# EAGLE design pidshield-mk-1 (EAGLE 6.5.0)
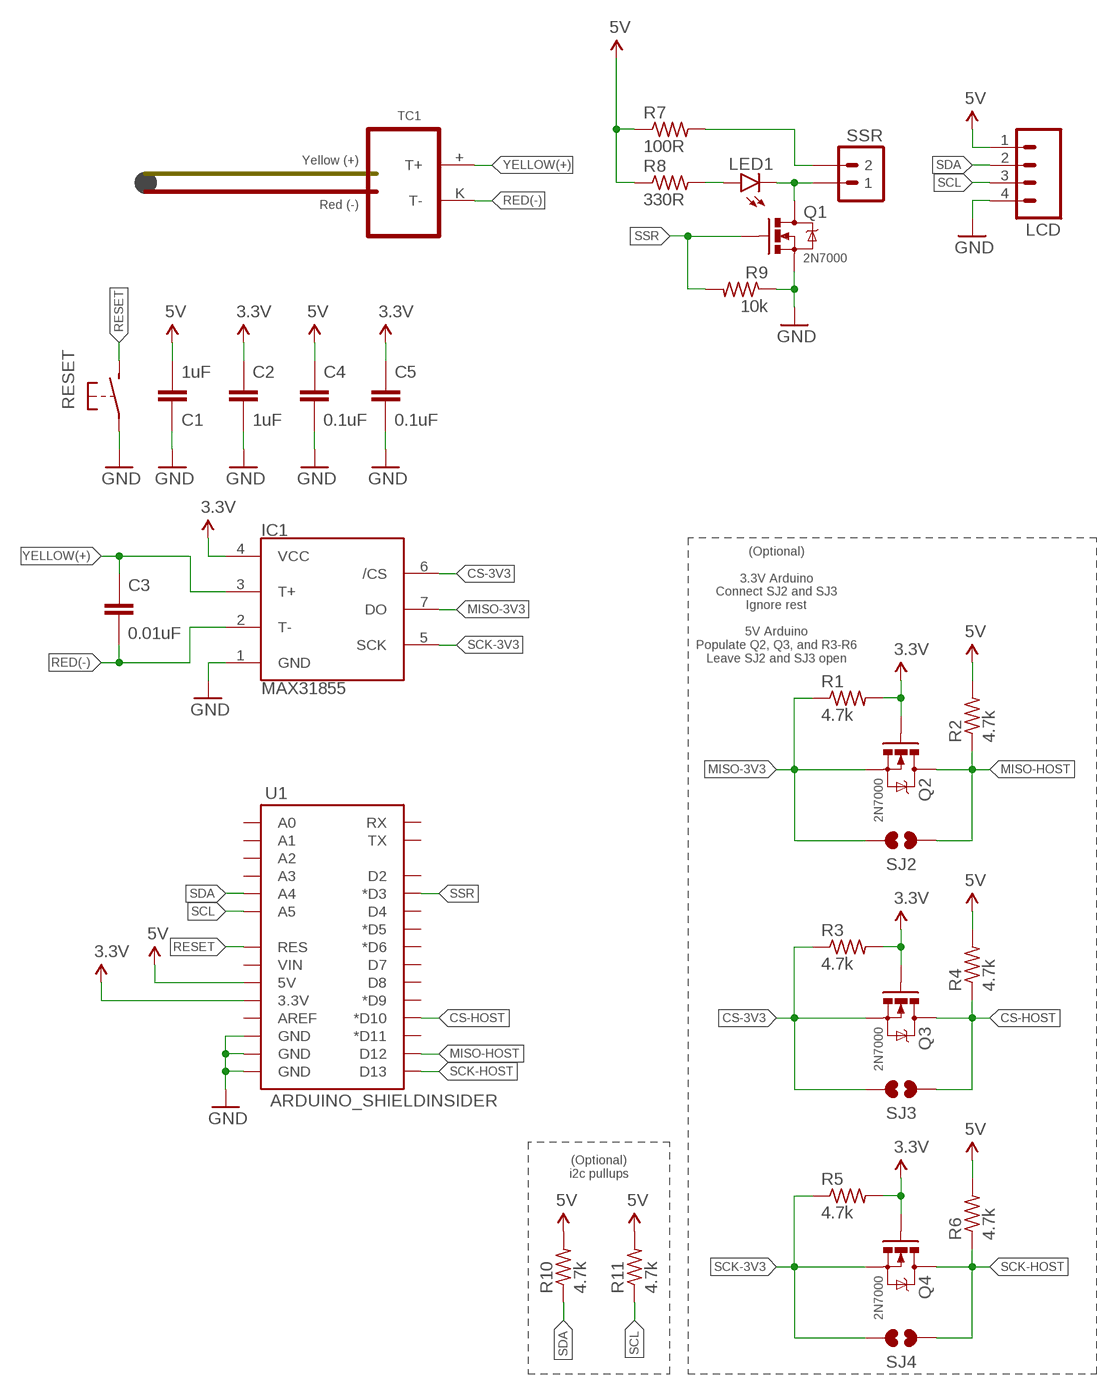
[diagram p0: schematic, sheet 1]

## Parts
C1  1uF  CAPACITOR-CERAMIC025-024X044  [C025-024X044]
C2  1uF  CAPACITOR-CERAMIC025-024X044  [C025-024X044]
C3  0.01uF  CAPACITOR-CERAMIC025-024X044  [C025-024X044]
C4  0.1uF  CAPACITOR-CERAMIC025-024X044  [C025-024X044]
C5  0.1uF  CAPACITOR-CERAMIC025-024X044  [C025-024X044]
IC1  MAX31855  MAX31855SOIC  [SOIC127P600X175-8N]
LCD  M04JST_XH_RA  [JST-4-XH-RA-PTH]
LED1  LED3MM  [LED3MM]
Q1  2N7000  MOSFET-NCHANNEL2N7000-AMMO  [TO-92-AMMO]
Q2  2N7000  MOSFET-NCHANNEL2N7000-AMMO  [TO-92-AMMO]
Q3  2N7000  MOSFET-NCHANNEL2N7000-AMMO  [TO-92-AMMO]
Q4  2N7000  MOSFET-NCHANNEL2N7000-AMMO  [TO-92-AMMO]
R1  4.7k  RESISTORPTH-AXIAL-6.35MM  [RESISTOR-AXIAL-PTH-6.35MM]
R2  4.7k  RESISTORPTH-AXIAL-6.35MM  [RESISTOR-AXIAL-PTH-6.35MM]
R3  4.7k  RESISTORPTH-AXIAL-6.35MM  [RESISTOR-AXIAL-PTH-6.35MM]
R4  4.7k  RESISTORPTH-AXIAL-6.35MM  [RESISTOR-AXIAL-PTH-6.35MM]
R5  4.7k  RESISTORPTH-AXIAL-6.35MM  [RESISTOR-AXIAL-PTH-6.35MM]
R6  4.7k  RESISTORPTH-AXIAL-6.35MM  [RESISTOR-AXIAL-PTH-6.35MM]
R7  100R  RESISTORPTH-AXIAL-6.35MM  [RESISTOR-AXIAL-PTH-6.35MM]
R8  330R  RESISTORPTH-AXIAL-6.35MM  [RESISTOR-AXIAL-PTH-6.35MM]
R9  10k  RESISTORPTH-AXIAL-6.35MM  [RESISTOR-AXIAL-PTH-6.35MM]
R10  4.7k  RESISTORPTH-AXIAL-6.35MM  [RESISTOR-AXIAL-PTH-6.35MM]
R11  4.7k  RESISTORPTH-AXIAL-6.35MM  [RESISTOR-AXIAL-PTH-6.35MM]
RESET  SPST-NO-TACT3MM-RA  [TACTILE-PTH-SIDE]
SJ2  JUMPER-PAD-2-NOYES_SILK  [PAD-JUMPER-2-NO_YES_SILK]
SJ3  JUMPER-PAD-2-NOYES_SILK  [PAD-JUMPER-2-NO_YES_SILK]
SJ4  JUMPER-PAD-2-NOYES_SILK  [PAD-JUMPER-2-NO_YES_SILK]
SSR  M02JST-PTH-RA-SMALLPADS  [JST-2-PH-RA-PTH-SMALLPADS]
TC1  PCC-SMP-K  THERMOCOUPLE-CONNECTORMINI-PCB  [PCC-SMP]
U1  ARDUINO_SHIELDINSIDER  [ARDUINO_SHIELD_NOOUTLINE_INSIDE]

## Nets
3.3V: C2.1 C5.1 IC1.4(VCC) Q2.2(G) Q3.2(G) Q4.2(G) R1.P$2 R3.P$2 R5.P$2 U1.3.3V
5V: C1.2 C4.1 LCD.1 R2.P$2 R4.P$2 R6.P$2 R7.P$1 R8.P$1 R10.P$2 R11.P$2 U1.5V
CS-3V3: IC1.6(/CS) Q3.1(S) R3.P$1 SJ3.2
CS-HOST: Q3.3(D) R4.P$1 SJ3.1 U1.D10(*D10)
GND: C1.1 C2.2 C4.2 C5.2 IC1.1(GND) LCD.4 Q1.1(S) R9.P$1 RESET.1 U1.GND@0(GND) U1.GND@1(GND) U1.GND@2(GND)
MISO-3V3: IC1.7(DO) Q2.1(S) R1.P$1 SJ2.2
MISO-HOST: Q2.3(D) R2.P$1 SJ2.1 U1.D12
N$2: LED1.A R8.P$2
N$3: LED1.K(C) Q1.3(D) SSR.1
N$4: R7.P$2 SSR.2
RED(-): C3.2 IC1.2(T-) TC1.K(T-)
RESET: RESET.2 U1.RES
SCK-3V3: IC1.5(SCK) Q4.1(S) R5.P$1 SJ4.2
SCK-HOST: Q4.3(D) R6.P$1 SJ4.1 U1.D13
SCL: LCD.3 R11.P$1 U1.A5
SDA: LCD.2 R10.P$1 U1.A4
SSR: Q1.2(G) R9.P$2 U1.D3(*D3)
YELLOW(+): C3.1 IC1.3(T+) TC1.+(T+)
Unconnected: U1.A0 U1.A1 U1.A2 U1.A3 U1.AREF U1.D2 U1.D4 U1.D5(*D5) U1.D6(*D6) U1.D7 U1.D8 U1.D9(*D9) U1.D11(*D11) U1.RX U1.TX U1.VIN

## Notes on the sheet
- (Optional)
  
  3.3V Arduino
  Connect SJ2 and SJ3
  Ignore rest
  
  5V Arduino
  Populate Q2, Q3, and R3-R6
  Leave SJ2 and SJ3 open
- (Optional)
  i2c pullups

## Library data of the parts
C1-C5 = A_butts:CAPACITOR-CERAMIC: CAPACITOR, European symbol
IC1 = A_butts:MAX31855
LCD = A_butts:M04: Header 4 Standard 4-pin 0.1" header. Use with straight break away headers (SKU : PRT-00116), right angle break away headers (PRT-00553), swiss pins (PRT-00743), machine pins (PRT-00117), and female headers (PRT-00115). Molex polarized connector foot print use with SKU : PRT-08231 with associated crimp pins and housings. 1MM SMD Version SKU: PRT-10208
LED1 = A_butts:LED: LEDs Standard schematic elements and footprints for 5mm, 3mm, 1206, and 0603 sized LEDs. 5mm - Spark Fun Electronics SKU : COM-00529 (and others)
Q1-Q4 = A_butts:MOSFET-NCHANNEL: Common NMOSFET Parts MFG P/N Store ID Prod ID FDD8780 TRANS-09984 SI7820DN TRANS-11055 FDS6630A IC-08089 2N7002PW TRANS-11151 FQP30N06L COM-10213 TRANS-10060 BSS123LT1G TRANS-08345 BSS138 TRANS-00830 BS170 2N7000
R1-R11 = A_butts:RESISTOR: RESISTOR, American symbol
RESET = A_butts:SPST-NO-TACT
SJ2-SJ4 = A_butts:JUMPER-PAD-2-NO
SSR = A_butts:M02: Standard 2-pin 0.1" header. Use with - straight break away headers ( PRT-00116) - right angle break away headers (PRT-00553) - swiss pins (PRT-00743) - machine pins (PRT-00117) - female headers (PRT-00115) Molex polarized connector foot print use with: PRT-08233 with associated crimp pins and housings. 2.54_SCREWTERM for use with PRT-10571. 3.5mm Screw Terminal footprints for PRT-08084 5mm Screw Terminal footprints for use with PRT-08433
TC1 = A_butts:THERMOCOUPLE-CONNECTOR
U1 = A_butts:ARDUINO_SHIELD: Arduino shield footprint

## Board
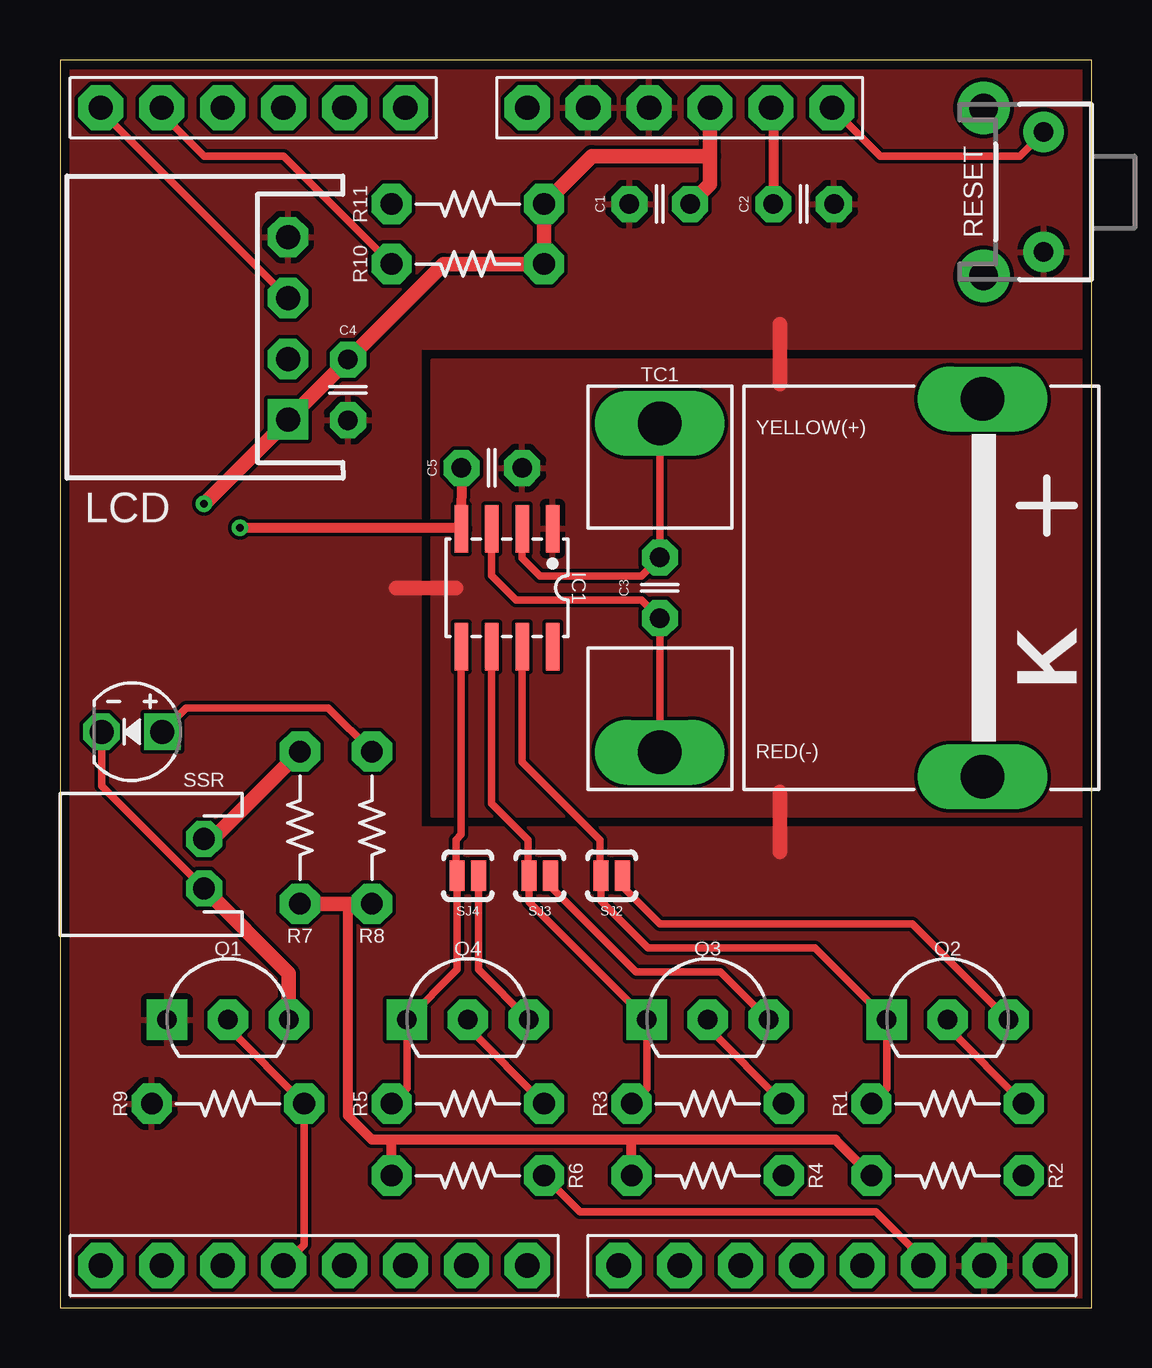
[diagram p1: board, top side]
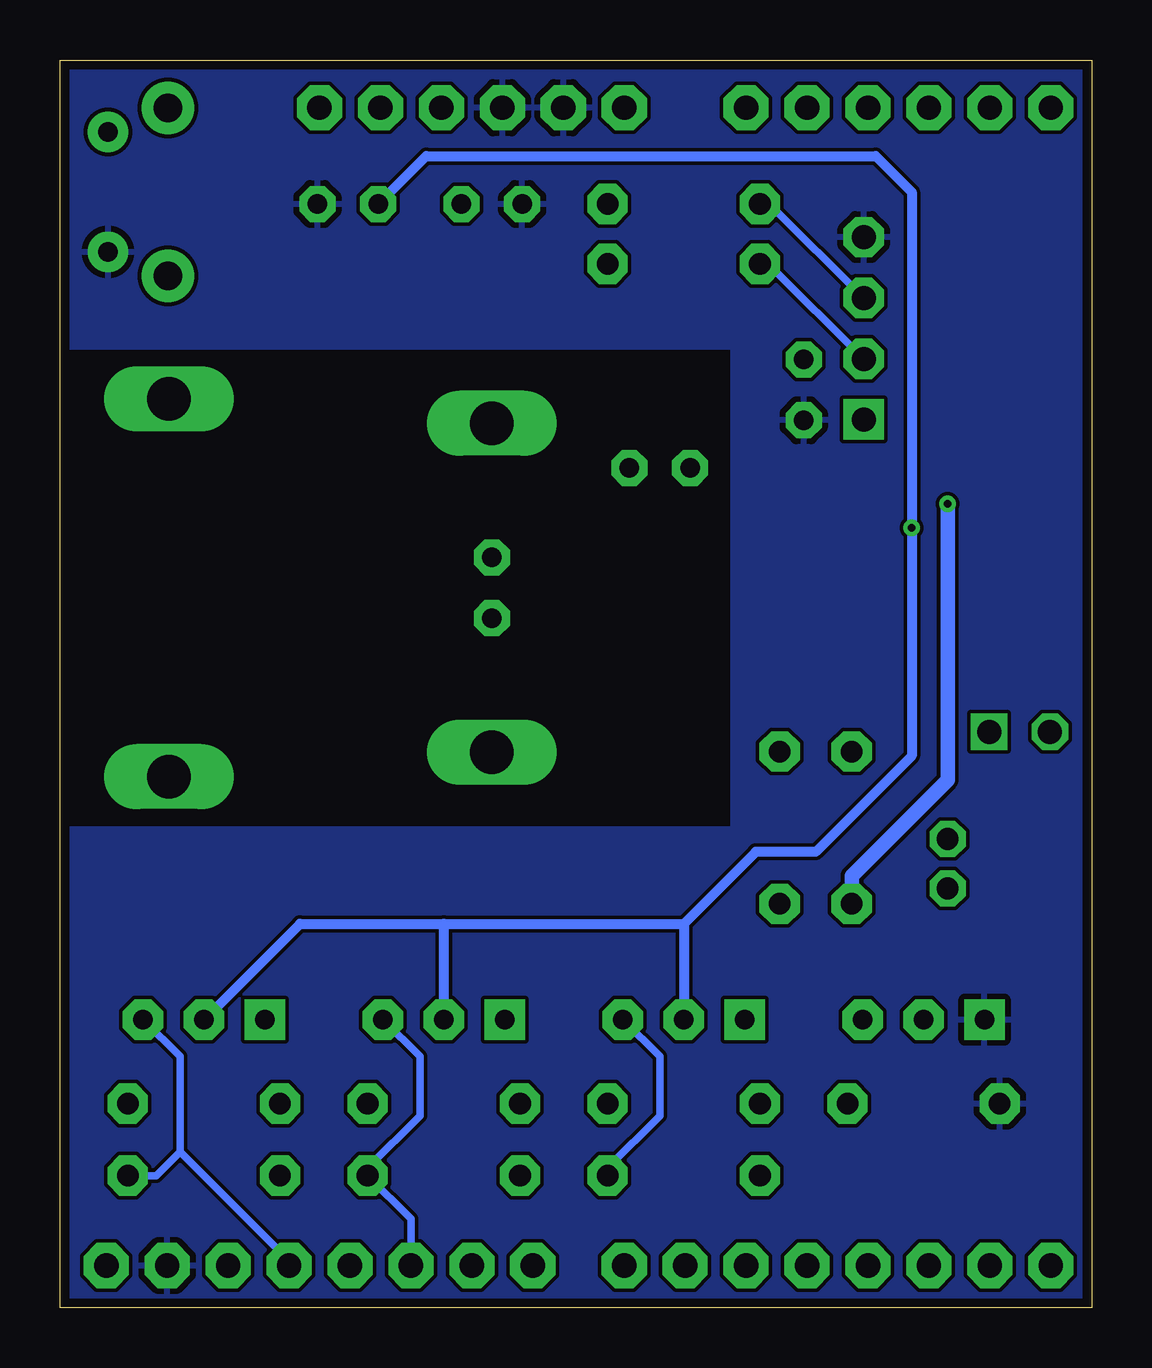
[diagram p2: board, bottom side, seen from below]

Size 43 x 52 mm. Coordinates in mm from the lower left corner, seen from the top.
Outline: 0,0 43,0 43,52 0,52 0,0
Copper layers (1*16): Top 0.0356mm / dielectric 1.5011mm / Bottom 0.0356mm
Design rules "LaenPCBOrder2": minimum track width 6mil, minimum drill 13mil, track to track 6mil, track to pad 6mil, pad to pad 6mil, via to via 6mil, smd to smd 6mil, copper to edge 15mil, drill to drill 6mil, minimum pad ring 7mil, minimum via ring 7mil, stop-mask expansion 3mil, vias tented up to drill 20mil, thermal gap 10mil

### Footprints (pad centres in the part's own frame; a part is rotated, then mirrored left to right if it is on the bottom)
C025-024X044 = drill 0.813 pad 1.5 octagon: 1 -1.27,0; 2 1.27,0
SOIC127P600X175-8N = smd 1.981 x 0.559: 1 -2.464,1.905; 2 -2.464,0.635; 3 -2.464,-0.635; 4 -2.464,-1.905; 5 2.464,-1.905; 6 2.464,-0.635; 7 2.464,0.635; 8 2.464,1.905
JST-4-XH-RA-PTH = drill 1 pad 1.676 square: 1 0.02,0 | drill 1 pad 1.676 octagon: 2 2.54,0; 3 5.08,0; 4 7.62,0
LED3MM = drill 1 pad 1.524 square: A -1.27,0 | drill 1 pad 1.524 octagon: K 1.27,0
TO-92-AMMO = drill 0.813 pad 1.676 square: 1 -2.54,0 | drill 0.813 pad 1.676 octagon: 2 0,0; 3 2.54,0
RESISTOR-AXIAL-PTH-6.35MM = drill 0.9 pad 1.676 octagon: P$1 -3.175,0; P$2 3.175,0
TACTILE-PTH-SIDE = drill 0.8 pad 1.7: 1 -2.5,0; 2 2.5,0 | drill 1.2 pad 2.2: ANCHOR1 -3.5,2.5; ANCHOR2 3.5,2.5
PAD-JUMPER-2-NO_YES_SILK = smd 0.635 x 1.27: 1 -0.45,0; 2 0.45,0
JST-2-PH-RA-PTH-SMALLPADS = drill 0.9 pad 1.5 octagon: 1 -1.03,0; 2 1.03,0
PCC-SMP = drill 1.8 long: + 0,-6.858; K 0,6.858; P$1 13.462,-7.874; P$2 13.462,7.874
ARDUINO_SHIELD_NOOUTLINE_INSIDE = drill 1.016 pad 1.88 octagon: 3.3V 48.26,-27.94; 5V 48.26,-25.4; A0 48.26,-12.7; A1 48.26,-10.16; A2 48.26,-7.62; A3 48.26,-5.08; A4 48.26,-2.54; A5 48.26,0; AREF 0,-39.37; D2 0,-5.08; D3 0,-7.62; D4 0,-10.16; D5 0,-12.7; D6 0,-15.24; D7 0,-17.78; D8 0,-21.59; D9 0,-24.13; D10 0,-26.67; D11 0,-29.21; D12 0,-31.75; D13 0,-34.29; GND@0 48.26,-22.86; GND@1 48.26,-20.32; GND@2 0,-36.83; RES 48.26,-30.48; RX 0,0; TX 0,-2.54; VIN 48.26,-17.78

### Placement (x,y rotation side)
C1  25,46 0 top
C2  31,46 0 top
C3  25,30 90 top
C4  12,38.25 270 top
C5  18,35 0 top
IC1  18.63,30 270 top
LCD  9.5,37 90 top
LED1  3,24 180 top
Q1  7,12 0 top
Q2  37,12 0 top
Q3  27,12 0 top
Q4  17,12 0 top
R1  37,8.5 0 top
R2  37,5.5 180 top
R3  27,8.5 0 top
R4  27,5.5 180 top
R5  17,8.5 0 top
R6  17,5.5 180 top
R7  10,20 90 top
R8  13,20 90 top
R9  7,8.5 0 top
R10  17,43.5 0 top
R11  17,46 0 top
RESET  41,46.5 90 top
SJ2  23,18 180 top
SJ3  20,18 180 top
SJ4  17,18 180 top
SSR  6,18.5 90 top
TC1  25,30 0 top
U1  1.7,1.75 90 top

### Tracks (layer width: path | path; a pad name or v marks a point on that pad's centre or on a via)
3.3V  (via drill 0.33)
  Top 0.305: R1.P$2 37,11.68 Q2.2 | R3.P$2 27,11.68 Q3.2 | R5.P$2 17,11.68 Q4.2
  Top 0.406: C5.1 IC1.4 | U1.3.3V 29.73,49.92 C2.1 | 16.69,32.5 v7.5,32.5
  Top 0.61: IC1.4 16.69,32.5
  Bottom 0.406: C2.1 27.73,48 9,48 7.5,46.5 v7.5,32.5 7.5,23 11.5,19 14,19 17,16 | 17,16 Q4.2 | Q3.2 27,16 | 27,16 17,16 | Q2.2 33,16 27,16
5V  (via drill 0.33)
  Top 0.406: R2.P$2 32.33,7 23.82,7 | 23.82,7 13.82,7 | 13.82,7 13,7 12,8 12,16.82 | R6.P$2 13.82,7 | R4.P$2 23.82,7 | LCD.1 9.5,37
  Top 0.61: C1.2 27.1,46.83 27.1,48 | 27.1,48 U1.5V | 27.1,48 22.18,48 R11.P$2 R10.P$2 15.98,43.5 C4.1 LCD.1 | R7.P$1 12,16.82 R8.P$1 | 9.5,37 v6,33.5
  Bottom 0.61: R7.P$1 10,18 6,22 v6,33.5
CS-3V3
  Top 0.305: R3.P$1 24.46,9.13 Q3.1 19.55,16.91 SJ3.2 19.5,18.05 19.5,19.5 18,21 IC1.6
CS-HOST
  Top 0.305: SJ3.1 20.45,17.55 24,14 27.54,14 Q3.3
  Bottom 0.305: Q3.3 28,10.46 28,8 30.18,5.83 R4.P$1 28.37,3.69 U1.D10
GND
  Top 0.61: 16.5,30 14,30 | 30,41 30,38.5 | 30,21.5 30,19
  pour Top: 43,0 0,0 0,52 43,52 43,40 15,40 15,20 43,20
  pour Top: 15.5,20.5 15.5,39.5 43,39.5 43,20.5
  pour Bottom: 43,0 0,0 0,52 43,52 43,40 15,40 15,20 43,20
MISO-3V3
  Top 0.305: R1.P$1 34.46,9.13 Q2.1 31.46,15 24.5,15 22.55,16.95 SJ2.2 22.5,18.05 22.5,19.5 19.27,22.73 IC1.7
MISO-HOST
  Top 0.305: SJ2.1 23.45,17.55 25,16 35.54,16 Q2.3
  Bottom 0.305: 38,6.5 38,10.46 Q2.3 | U1.D12 33.45,1.95 38,6.5 | R2.P$1 39,5.5 38,6.5
N$2
  Top 0.305: LED1.A 5.27,25 11.18,25 R8.P$2
N$3
  Top 0.305: LED1.K 1.73,21.74 SSR.1
  Top 0.61: SSR.1 9.54,13.93 Q1.3
N$4
  Top 0.61: SSR.2 6.36,19.53 R7.P$2
RED(-)
  Top 0.305: IC1.2 19.27,31.23 20,30.5 24.23,30.5 C3.2 TC1.K
RESET
  Top 0.305: U1.RES 34.19,48 40,48 RESET.2
SCK-3V3
  Top 0.305: R5.P$1 14.46,9.13 Q4.1 16.55,14.09 SJ4.2 16.5,18.05 16.5,19.5 16.73,19.73 IC1.5
SCK-HOST
  Top 0.305: Q4.3 17.45,14.09 SJ4.1 | U1.D13 35.99,2.01 34,4 21.68,4 R6.P$1
  Bottom 0.305: R6.P$1 20.18,5.83 18,8 18,10.46 Q4.3
SCL
  Top 0.305: U1.A5 1.7,49.88 LCD.3
  Bottom 0.305: R11.P$1 13.42,46 LCD.3
SDA
  Top 0.305: U1.A4 4.24,49.76 6,48 9.32,48 R10.P$1
  Bottom 0.305: R10.P$1 13.46,43.5 LCD.2
SSR
  Top 0.305: Q1.2 7,11.68 R9.P$2 10.18,2.6 U1.D3
YELLOW(+)
  Top 0.305: IC1.3 18,30.5 19,29.5 24.23,29.5 C3.1 TC1.+